# Altium schematic sheet 2_AD9833.schdoc
size 309 x 223 mm; Symbol: Sheet-Symbol_A4; Device: Sheet-Symbol_A4; @Page Name: AD9833; @Create Date: 2023-12-22; @Page Count: 3; @Page No: 2; @Project Name: DDS; @Schematic Name: DDS_1; @Update Date: 2023-12-27; Company: 嘉立创EDA; Page Size: A3; Version: V1.0
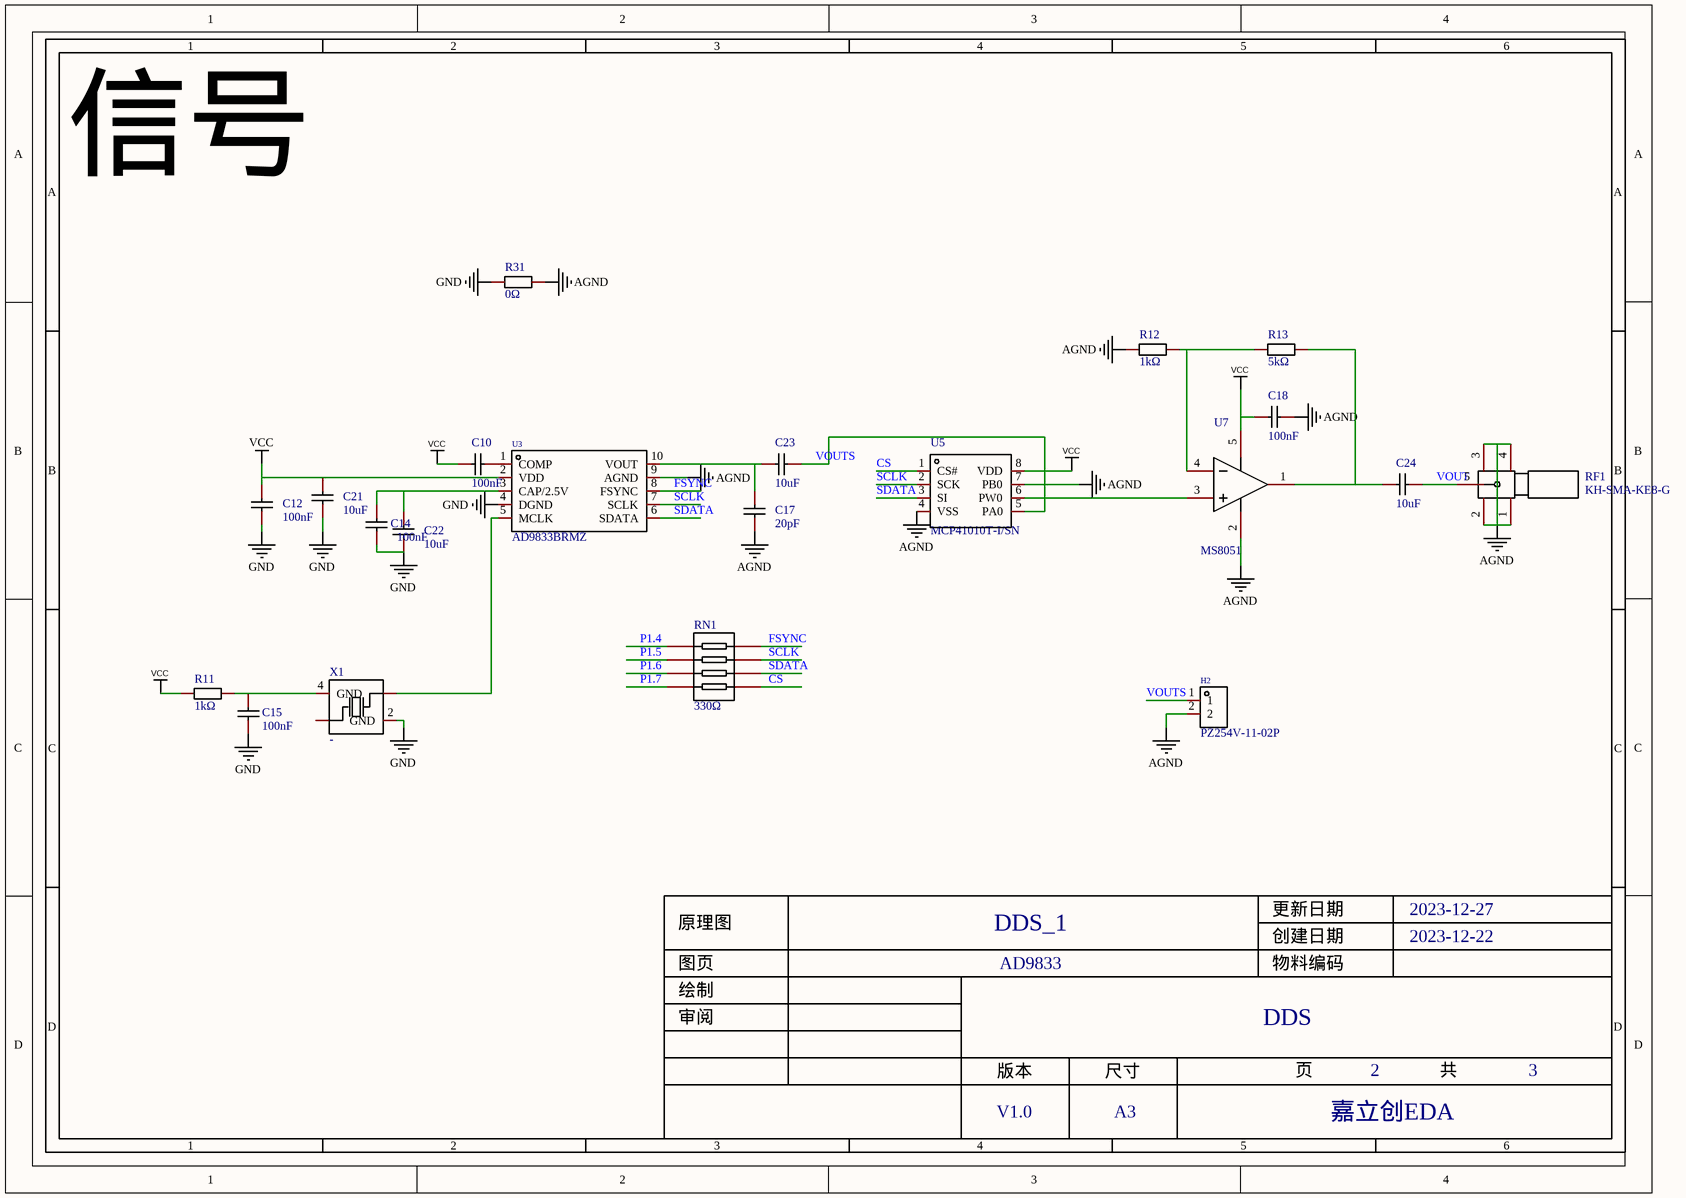
[diagram p0: 2_AD9833.schdoc]

## Parts
C10  100nF  [C0805]
C12  100nF  [C0805]
C14  100nF  [C0805]
C15  100nF  [C0805]
C17  20pF  [C0805]
C18  100nF  [C0805]
C21  10uF  [C1206]
C22  10uF  [C1206]
C23  10uF  [C1206]
C24  10uF  [C1206]
H2  PZ254V-11-02P  [HDR-TH_2P-P2.54-V-M]
R11  1kΩ  [R0805]
R12  1kΩ  [R0805]
R13  5kΩ  [R0805]
R31  0Ω  [R0805]
RF1  KH-SMA-KE8-G  [CONN-SMD_KH-SMA-KE8-G]
RN1  330Ω  [RES-ARRAY-SMD_0603-8P-L3.2-W1.6-BL]
U3  AD9833BRMZ  [MSOP-10_L3.0-W3.0-P0.50-LS5.0-BL]
U5  MCP41010T-I/SN  [SOIC-8_L4.9-W3.9-P1.27-LS6.0-BL]
U7  MS8051  [SOT-23-5_L3.0-W1.7-P0.95-LS2.8-BL]
X1  -  [CRYSTAL-SMD_4P-L3.2-W2.5-BL]

## Nets
AGND: C17.1 C18.2 H2.2 R12.1 R31.2 RF1.1 RF1.2 RF1.3 RF1.4 U3.9(AGND) U5.4(VSS) U5.7(PB0) U7.2(VSS)
GND: C12.1 C14.1 C15.1 C21.1 C22.1 R31.1 U3.4(DGND) X1.2(GND)
VCC: C10.1 C12.2 C18.1 C21.2 R11.1 U3.2(VDD) U5.8(VDD) U7.5(VDD)
CS: RN1.5 U5.1(CS#)
FSYNC: RN1.8 U3.8(FSYNC)
P1.4: RN1.1
P1.5: RN1.2
P1.6: RN1.3
P1.7: RN1.4
SCLK: RN1.7 U3.7(SCLK) U5.2(SCK)
SDATA: RN1.6 U3.6(SDATA) U5.3(SI)
VOUT: C24.2 RF1.5
VOUTS: C23.2 H2.1 U5.5(PA0)
NetC10_2: C10.2 U3.1(COMP)
NetC14_2: C14.2 C22.2 U3.3(CAP/2.5V)
NetC15_2: C15.2 R11.2 X1.4(GND)
NetC17_2: C17.2 C23.1 U3.10(VOUT)
NetC24_1: C24.1 R13.2 U7.1(OUT)
NetR12_2: R12.2 R13.1 U7.4(IN-)
NetU3_5: U3.5(MCLK) X1.3(OSC2)
NetU5_6: U5.6(PW0) U7.3(IN+)

Not connected (* = marked no-connect by the designer): X1 1(OSC1)

## Notes on the sheet
- 信号
- 1
- 2
- 3
- 4
- 5
- 6
- A
- B
- C
- 原理图
- DDS_1
- 创建日期
- 更新日期
- 2023-12-22
- 2023-12-27
- 审阅
- 绘制
- 图页
- AD9833
- 物料编码
- DDS
- D
- 版本
- 尺寸
- 页
- 共
- V1.0
- A3
- 嘉立创EDA

## Library data of the parts
C10 C12 C14 C15 C17 C18 = 0805B104K500NT: 容值:100nF;精度:±10%;额定电压:50V;材质(温度系数):X7R;; Manufacturer: FH(风华); Add into BOM: yes; Tolerance: ±10%; Voltage Rated: 50V; Temperature Coefficient: X7R; Symbol: 0805B104K500NT; Device: 0805B104K500NT; LCSC Part Name: 100nF ±10% 50V; Supplier Part: C38141; Manufacturer Part: 0805B104K500NT; Supplier Footprint: 0805; Datasheet: https://atta.szlcsc.com/upload/public/pdf/source/20200305/C486355_26A10D38EF8C2A5C37091D0039909270.pdf; Supplier: LCSC; Convert to PCB: yes
  C10 C12 C14 C15 C18: Name: 100nF; Value: 100nF
  C17: Name: 20pF; Value: 20pF
C21-C24 = CL31A106KBHNNNE: 容值:10uF;精度:±10%;额定电压:50V;材质(温度系数):X5R;; Manufacturer: SAMSUNG(三星); Add into BOM: yes; Tolerance: ±10%; Voltage Rated: 50V; Temperature Coefficient: X5R; Name: 10uF; Symbol: CL31A106KBHNNNE; Device: CL31A106KBHNNNE; LCSC Part Name: 10uF ±10% 50V; Supplier Part: C13585; Manufacturer Part: CL31A106KBHNNNE; Supplier Footprint: 1206; Datasheet: https://atta.szlcsc.com/upload/public/pdf/source/20160218/1457707763339.pdf; Supplier: LCSC; Convert to PCB: yes; Value: 10uF
H2 = PZ254V-11-02P: 排数:单排;总PIN位数:2P;间距:2.54mm;插针结构:1x2P;行距:-;安装类型:直插;圆针/方针:方针;额定电流:-;额定电压:-;配合针长度:6mm;塑高:2.5mm;端接针长度:3mm;触头材质:黄铜;触头镀层:-;工作温度范围:-40℃~+105℃;颜色:黑色;; Manufacturer: XFCN(兴飞); Add into BOM: yes; Pitch: 2.54mm; Pin Structure: 1x2P; Circluar Pins/Square Pins: 方针; Name: PZ254V-11-02P; Symbol: PZ254V-11-02P; Device: PZ254V-11-02P; LCSC Part Name: 2.54mm 1x2P 直插 方针; Supplier Part: C492401; Manufacturer Part: PZ254V-11-02P; Supplier Footprint: 插件,P=2.54mm; Datasheet: https://atta.szlcsc.com/upload/public/pdf/source/20200309/C492401_A812433581A9B211A7FFA413ADDFF0E5.pdf; Supplier: LCSC; Convert to PCB: yes; Number of Rows: 单排; Number of Pins: 2P; Row Spacing: -; Mounting Type: 直插; Current Rating (Max): -; Voltage Rating (Max): -; Length of Mating Pin: 6mm; Insulation Height: 2.5mm; Length of End Connection Pin: 3mm; Contact Material: 黄铜; Contact Plating: -; Operating Temperature Range: -40℃~+105℃; Color: 黑色
R11-R13 = 0805W8F1001T5E: 阻值:1kΩ;精度:±1%;功率:125mW;温度系数:±100ppm/℃;电阻类型:厚膜电阻;; Manufacturer: UNI-ROYAL(厚声); Add into BOM: yes; Tolerance: ±1%; Power(Watts): 125mW; Overload Voltage (Max): 150V; Symbol: 0805W8F1001T5E; Device: 0805W8F1001T5E; LCSC Part Name: 1kΩ ±1% 125mW 厚膜电阻; Supplier Part: C17513; Manufacturer Part: 0805W8F1001T5E; Supplier Footprint: 0805; Datasheet: https://atta.szlcsc.com/upload/public/pdf/source/20200306/C422600_1E6D84923E4A46A82E41ADD87F860B5C.pdf; Supplier: LCSC; Convert to PCB: yes; Temperature Coefficient: ±100ppm/℃; Type: 厚膜电阻; Operating Temperature Range: -55℃~+155℃
  R11 R12: Name: 1kΩ; Value: 1kΩ
  R13: Name: 5kΩ; Value: 5kΩ
R31 = 0805W8F0000T5E: 电阻类型:厚膜电阻;阻值:0Ω;精度:±1%;功率:125mW;; Manufacturer: UNI-ROYAL(厚声); Add into BOM: yes; Tolerance: ±1%; Power(Watts): 125mW; Temperature Coefficient: ±800ppm/℃; Overload Voltage (Max): 150V; Name: 0Ω; Symbol: 0805W8F0000T5E; Device: 0805W8F0000T5E; Convert to PCB: yes; LCSC Part Name: 0Ω ±1% 125mW; Supplier Part: C17477; Manufacturer Part: 0805W8F0000T5E; Supplier Footprint: 0805; JLCPCB Part Class: 基础库; Datasheet: https://atta.szlcsc.com/upload/public/pdf/source/20200306/C422600_1E6D84923E4A46A82E41ADD87F860B5C.pdf; Supplier: LCSC; Type: 厚膜电阻; Value: 0Ω; Operating Temperature Range: -55℃~+155℃
RF1 = KH-SMA-KE8-G: 连接器类型:板端;接口类型:内孔;频率-最大值:-;接口直径:-;射频系列:SMA;端口数量:1;阻抗:-;样式:偏脚;接口长度/高度:8mm;工作温度范围:-;; Manufacturer: kinghelm(金航标); Add into BOM: yes; Connector Type: 板端; Interface Type: 内孔; RF Series: SMA; Number of Ports: 1; Style: 偏脚; Interface Length/Height: 8mm; Name: KH-SMA-KE8-G; Symbol: KH-SMA-KE8-G; Device: KH-SMA-KE8-G; LCSC Part Name: SMA 内孔 偏脚 镀金外螺内孔侧插半牙; Supplier Part: C530661; Manufacturer Part: KH-SMA-KE8-G; Supplier Footprint: 插件; Datasheet: https://atta.szlcsc.com/upload/public/pdf/source/20200512/C530661_F969D51668E6BC228544FB5FCDBC3D39.pdf; Supplier: LCSC; Convert to PCB: yes; Frequency-Max: -; Interface Diameter: -; Impedance: -; Operating Temperature Range: -
RN1 = 4D03WGJ0331T5E: 阻值:330Ω;精度:±5%;单个元件功率:62.5mW;电阻器数:4;温度系数:±200ppm/℃;; Manufacturer: UNI-ROYAL(厚声); Add into BOM: yes; Tolerance: ±5%; Power(Watts): 62.5mW; Number of Resistors: 4; Name: 330Ω; Symbol: 4D03WGJ0331T5E; Device: 4D03WGJ0331T5E; LCSC Part Name: 330Ω ±5% 0603x4; Supplier Part: C12018; Manufacturer Part: 4D03WGJ0331T5E; Supplier Footprint: 0603x4; Datasheet: https://atta.szlcsc.com/upload/public/pdf/source/20191224/C474318_2527498AE30E813171187CCD28401A71.pdf; Supplier: LCSC; Convert to PCB: yes; Value: 330Ω; Temperature Coefficient: ±200ppm/℃; Number of Pins: 8
U3 = AD9833BRMZ: 电源电压:2.3V~5.5V;分辨率(位):10;自宽调谐(最大值):28b;; Manufacturer: ADI(亚德诺); Symbol: AD9833BRMZ_C1519069; Add into BOM: yes; Resolution (Bits): 10; Tuning  Word Width(Max): 28b; Name: AD9833BRMZ; Device: AD9833BRMZ; LCSC Part Name: AD9833BRMZ; Supplier Part: C1519069; Manufacturer Part: AD9833BRMZ; Supplier Footprint: MSOP-10; Datasheet: https://atta.szlcsc.com/upload/public/pdf/source/20200901/C653879_C7354661FE492369EE1E91E5EF14B86B.pdf; Supplier: LCSC; Convert to PCB: yes; Supply Voltage: 2.3V~5.5V; Operating Temperature: -40℃~+105℃
U5 = MCP41010T-I/SN: 供电电压:2.7V~5.5V;电阻值(欧姆):10kΩ;精度:±20%;接口类型:SPI;; Manufacturer: MICROCHIP(美国微芯); Add into BOM: yes; Resistance Value (Ohms): 10kΩ; Number of Taps: 256; Temperature Coefficient (Typ): 800ppm/℃; Precision: ±20%; Number of Channels: 1; Interface Type: SPI; Name: MCP41010T-I/SN; Symbol: MCP41010T-I/SN; Device: MCP41010T-I/SN; LCSC Part Name: MCP41010T-I/SN; Supplier Part: C136395; Manufacturer Part: MCP41010T-I/SN; Supplier Footprint: SOP-8; Datasheet: https://atta.szlcsc.com/upload/public/pdf/source/20220205/C2666606_C5E8E7A5F3891B321C1555D845654E7B.pdf; Supplier: LCSC; Convert to PCB: yes; Supply Voltage: 2.7V~5.5V; Operating Temperature: -40℃~+85℃; Value: -
U7 = CBM8051AST5: 运放类型:-;放大器组数:-;增益带宽积（GBP）:-;压摆率（SR）:-;电源电压:-;各通道供电电流:-;; Manufacturer: Corebai(芯佰微); Add into BOM: yes; Name: MS8051; Symbol: CBM8051AST5; Device: CBM8051AST5; LCSC Part Name: CBM8051AST5; Supplier Part: C476380; Manufacturer Part: MS8051; Supplier Footprint: SOT23-5; Datasheet: https://atta.szlcsc.com/upload/public/pdf/source/20191226/C476380_2AF80F7EA45B68711FF91A892353CB75.pdf; Supplier: LCSC; Convert to PCB: yes; Amplifier Type: -; Number of Circuits: -; -3db Bandwidth（G=1）: -; Current - Input Bias（Ib）: -; Voltage - Input Offset（Vos）: -; Gain Bandwidth Product（GBP）: -; Slew Rate（SR）: -; Output Type: -; Supply Voltage（Single）: -; Iq per channel (Typ): -; Operating Temperature: -
X1 = SX32Y025000BK1T: 频率:-;负载电容:-;; Manufacturer: TKD(泰晶); Add into BOM: yes; Name: -; Symbol: SX32Y025000BK1T; Device: SX32Y025000BK1T; LCSC Part Name: 3225 25M 20PF  10ppm  -20 -75℃; Supplier Part: C271633; Manufacturer Part: SX32Y025000BK1T; Supplier Footprint: SMD3225-4P; Datasheet: https://atta.szlcsc.com/upload/public/pdf/source/20180829/C271633_6A66B3511E9F0F5234F0D29165E9418D.pdf; Supplier: LCSC; Convert to PCB: yes; Crystal Type: -; Value: -; Load Capacitance: -; Operating Temperature: -